# Altium schematic sheet Key_LED_Buzzer.SchDoc
size A3; SheetNumber: 8; SheetTotal: 12
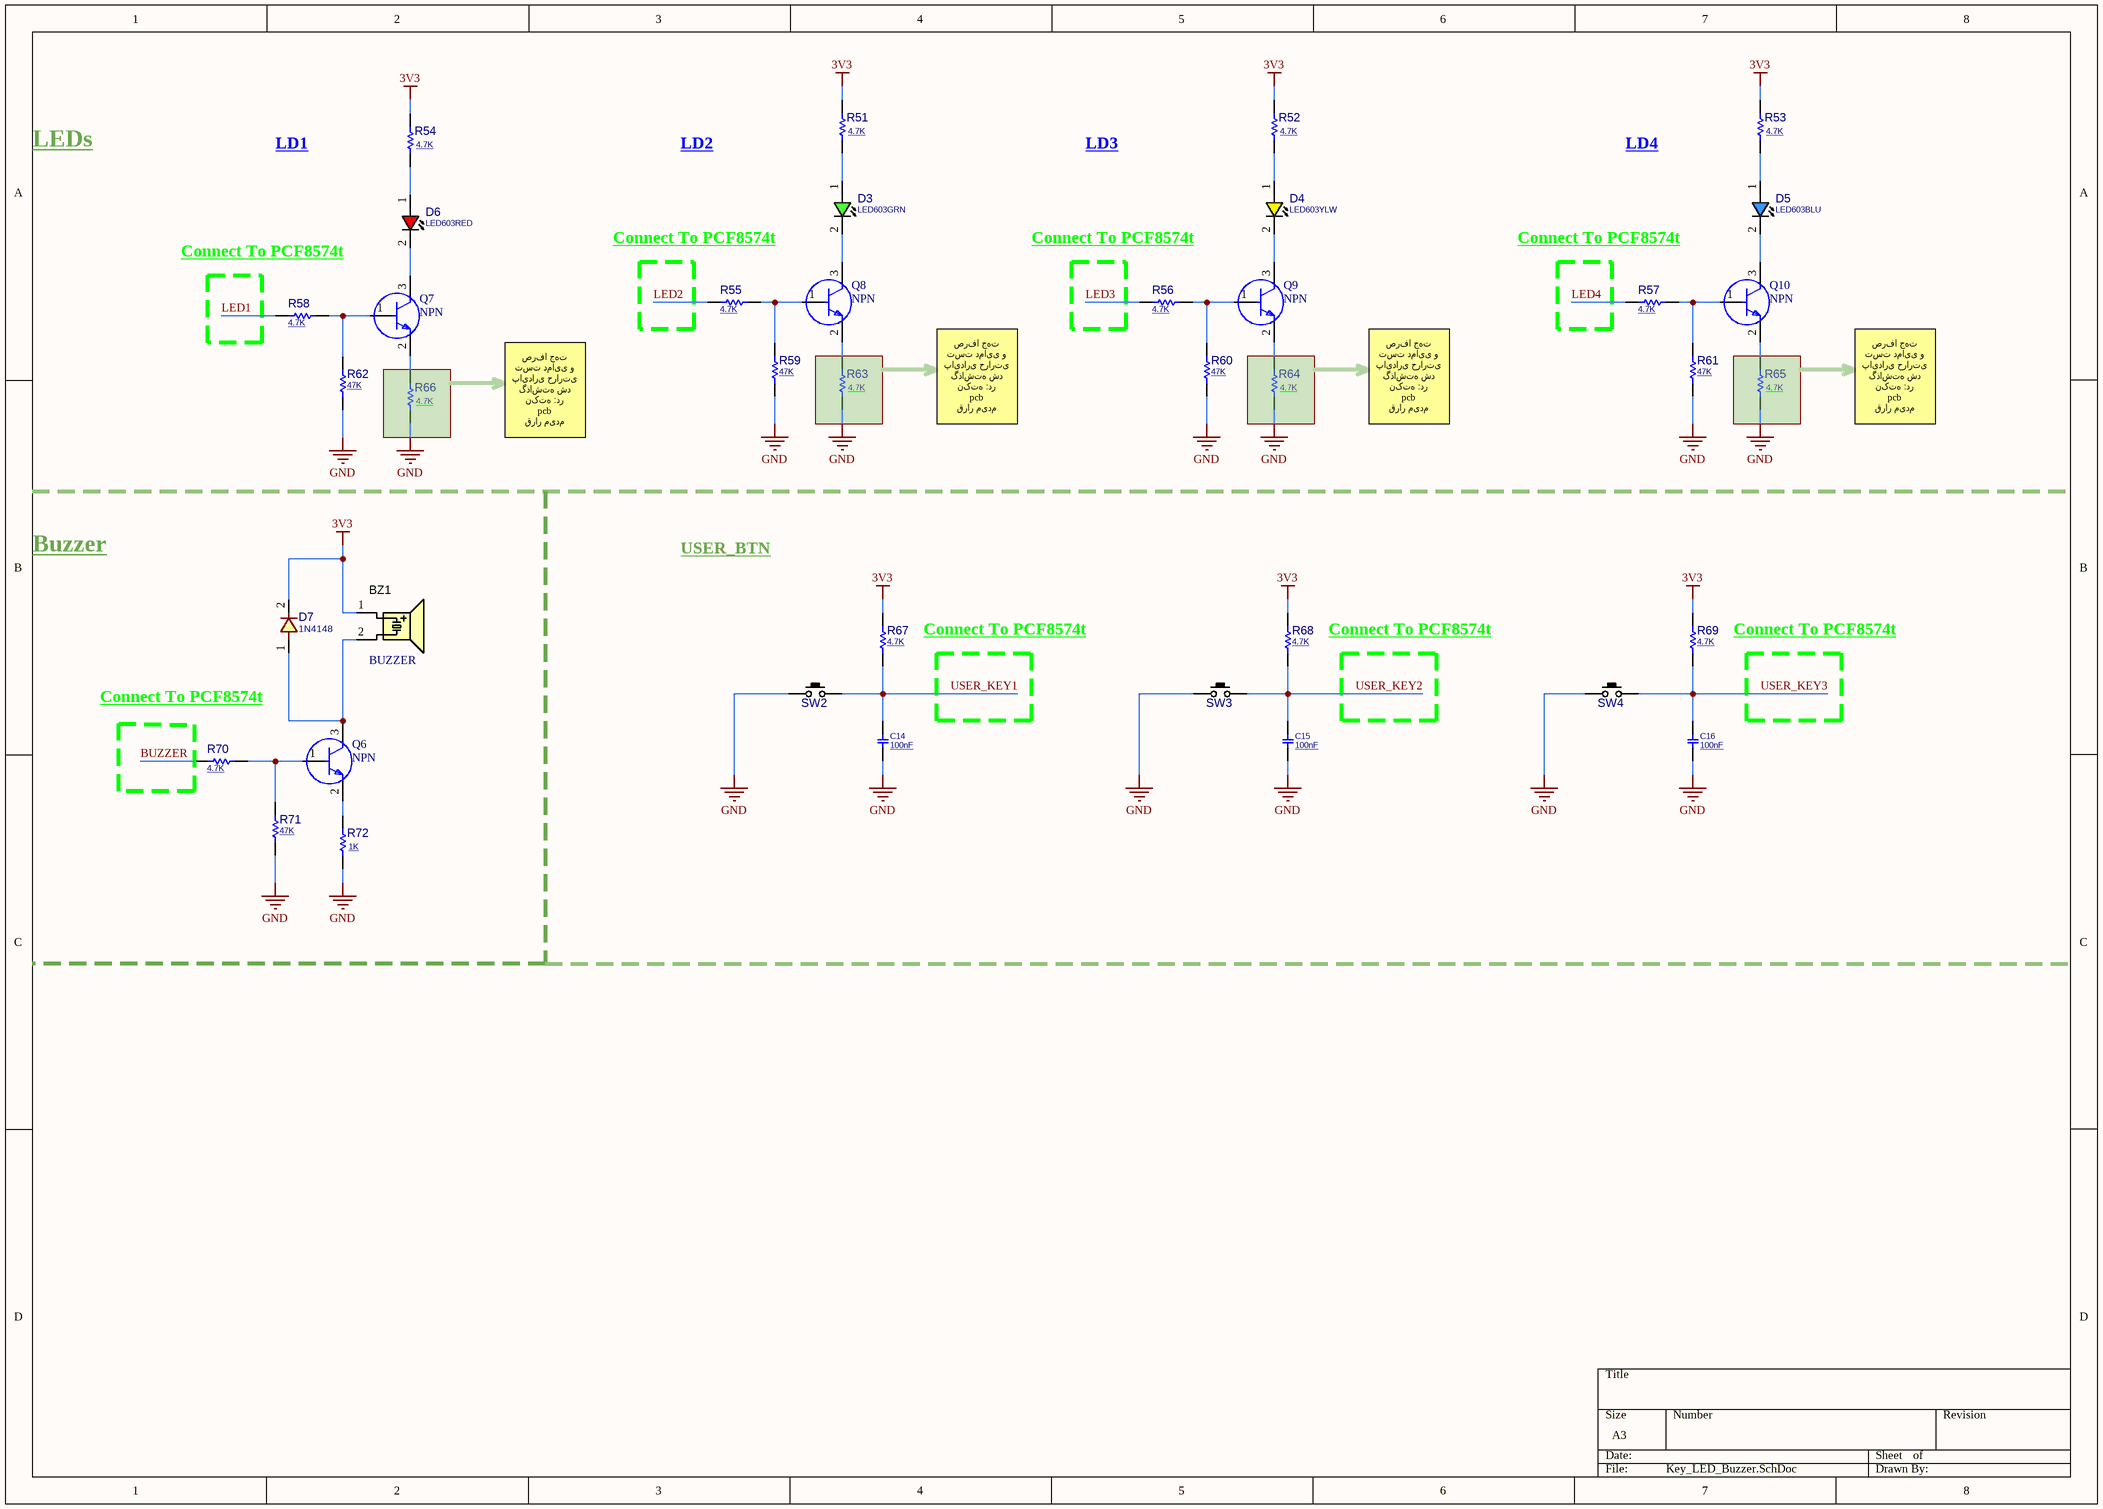
[diagram p0: Key_LED_Buzzer.SchDoc]

## Parts
BZ1  BUZZER  [BZ_SMD_S8]
C14  100nF  [C0603]
C15  100nF  [C0603]
C16  100nF  [C0603]
D3  LED603GRN  [LED0603GRN]
D4  LED603YLW  [LED0603YLW]
D5  LED603BLU  [LED0603BLU]
D6  LED603RED  [LED0603RED]
D7  1N4148  [D_SOD80]
Q6  NPN  [FP-SOT23-IPC_A]
Q7  NPN  [FP-SOT23-IPC_A]
Q8  NPN  [FP-SOT23-IPC_A]
Q9  NPN  [FP-SOT23-IPC_A]
Q10  NPN  [FP-SOT23-IPC_A]
R51  4.7K  [R0603]
R52  4.7K  [R0603]
R53  4.7K  [R0603]
R54  4.7K  [R0603]
R55  4.7K  [R0603]
R56  4.7K  [R0603]
R57  4.7K  [R0603]
R58  4.7K  [R0603]
R59  47K  [R0603]
R60  47K  [R0603]
R61  47K  [R0603]
R62  47K  [R0603]
R63  4.7K  [R0603]
R64  4.7K  [R0603]
R65  4.7K  [R0603]
R66  4.7K  [R0603]
R67  4.7K  [R0603]
R68  4.7K  [R0603]
R69  4.7K  [R0603]
R70  4.7K  [R0603]
R71  47K  [R0603]
R72  1K  [R0603]
SW2  PUSHBUTTON  [SWPBS_SPST_6X3X5]  (value not drawn)
SW3  PUSHBUTTON  [SWPBS_SPST_6X3X5]  (value not drawn)
SW4  PUSHBUTTON  [SWPBS_SPST_6X3X5]  (value not drawn)

## Nets
3V3: BZ1.1(A) D7.2 R51.2 R52.2 R53.2 R54.2 R67.1 R68.1 R69.1
GND: C14.1 C15.1 C16.1 R59.2 R60.2 R61.2 R62.2 R63.1 R64.1 R65.1 R66.1 R71.2 R72.1 SW2.1(P1) SW3.1(P1) SW4.1(P1)
BUZZER: R70.2
LED1: R58.2
LED2: R55.2
LED3: R56.2
LED4: R57.2
USER_KEY1: C14.2 R67.2 SW2.2(P3)
USER_KEY2: C15.2 R68.2 SW3.2(P3)
USER_KEY3: C16.2 R69.2 SW4.2(P3)
NetBZ1_2: BZ1.2(B) D7.1 Q6.3(C)
NetD3_1: D3.1(ANODE) R51.1
NetD3_2: D3.2(CATHODE) Q8.3(C)
NetD4_1: D4.1(ANODE) R52.1
NetD4_2: D4.2(CATHODE) Q9.3(C)
NetD5_1: D5.1(ANODE) R53.1
NetD5_2: D5.2(CATHODE) Q10.3(C)
NetD6_1: D6.1(ANODE) R54.1
NetD6_2: D6.2(CATHODE) Q7.3(C)
NetQ6_1: Q6.1(B) R70.1 R71.1
NetQ6_2: Q6.2(E) R72.2
NetQ7_1: Q7.1(B) R58.1 R62.1
NetQ7_2: Q7.2(E) R66.2
NetQ8_1: Q8.1(B) R55.1 R59.1
NetQ8_2: Q8.2(E) R63.2
NetQ9_1: Q9.1(B) R56.1 R60.1
NetQ9_2: Q9.2(E) R64.2
NetQ10_1: Q10.1(B) R57.1 R61.1
NetQ10_2: Q10.2(E) R65.2

## Notes on the sheet
- LEDs
- LD1
- LD2
- LD3
- LD4
- Connect To PCF8574t
- صرفا جهت تست دمایی و پایداری حرارتی گذاشته شد نکته :در
  pcb
  قرار میدم
- Buzzer
- USER_BTN
- (near R67) Connect To PCF8574t
- (near R68) Connect To PCF8574t
- (near R69) Connect To PCF8574t

## Library data of the parts
BZ1 = BZ_SMD_8X8X3: Buzzer, SMD, sealed 8.5x8.5x3mm LWH , 3Vp; PARAM: 2700 Hz, Magnetic; PARAM2: 2.7kHz, 85dBA @ 10cm; MANF: cre-sound; MANF_P#: LET8530BS-03L-2.7-16-R; PRICE: 2t@Javan; Value: BUZZER
C14-C16 = CAP_SMD_MLCC_0603: CAP, MLCC, -F, -V, MATERIAL, -%, 0201; PARAM: -, -%; MANF_P#: MANF_PART#; PRICE: 100= 1$; MANF: -; PARAM2: -V; ASSEMBLY: ASSEMBLY; VALUE: 100nF
D3 = LED_SMD_0603_GRN: LED, SMD, 0603, GREEN; PARAM: 20mA; MANF: Kingbright; DESC: DESCRIPTION; MANF_P#: APT1608SGC; PARAM2: 2.2V; ASSEMBLY: ASSEMBLY; PRICE: 1: 0.14$, 100: 6.8$; VALUE: LED603GRN
D4 = LED_SMD_0603_YLW: LED, SMD, 0603, YELLOW; DESC: DESCRIPTION; MANF_P#: MANF_PART#; PARAM2: 2.2V; MANF: MANF; ASSEMBLY: ASSEMBLY; PRICE: PRICE; VALUE: LED603YLW
D5 = LED_SMD_0603_BLU: LED, SMD, 0603, BLUE; PARAM: 30mA, 470nm, 120° Angle; DESC: DESCRIPTION; MANF_P#: MANF_PART#; PARAM2: 2.2~3V; MANF: MANF; ASSEMBLY: ASSEMBLY; PRICE: PRICE; VALUE: LED603BLU
D6 = LED_SMD_0603_RED: LED, SMD, 0603, RED; PARAM: 30mA, 640nm; DESC: DESCRIPTION; MANF_P#: MANF_PART#; PARAM2: 1.8~2.5V; MANF: MANF; ASSEMBLY: ASSEMBLY; PRICE: PRICE; VALUE: LED603RED
D7 = DIODE_SMD_1N4148_SOD80: DIODE, FAST SWTICHING, 0.3A, 0.5W; DESC: DESCRIPTION; PARAM: 75V; PARAM2: 300mA, 0.5W; MANF: MANF; ASSEMBLY: ASSEMBLY; PRICE: PRICE; MANF_P#: 1N4148; VALUE: 1N4148
Q6-Q10 = CMP-2000-04931-2: Frequency: 300MHz; Collector Emitter Voltage (VCEO): 40V; Power Dissipation: 350mW; Element Configuration: Single; Max Power Dissipation: 300mW; Max Collector Current: 200mA; Collector Emitter Saturation Voltage: 300mV; Number of Elements: 1; hFE Min: 100; Collector Base Voltage (VCBO): 60V; Emitter Base Voltage (VEBO): 6V; Contact Plating: Tin; Package Quantity: 3000; Max Frequency: 300MHz; REACH SVHC: No SVHC; Max Operating Temperature: 150°C; Width: 1.4mm; Voltage Rating (DC): 40V; Radiation Hardening: No; Case/Package: SOT-23; Height: 1mm; Collector Emitter Breakdown Voltage: 40V; Length: 3.05mm; Polarity: NPN; Packaging: Tape and Reel; Number of Pins: 3; Min Operating Temperature: -55°C; Gain Bandwidth Product: 300MHz; Mount: Surface Mount; Weight: 0.000282oz; Continuous Collector Current: 200mA; Transition Frequency: 300MHz; Max Breakdown Voltage: 40V; Lead Free: Lead Free
R51-R72 = RES_SMD: RESISTOR, SMD; PARAM: -W; DESC: DESCRIPTION; DIST#: MOUSER; PARAM2: 1%; MANF_P#: -; MANF: -; ASSEMBLY: ASSEMBLY; PRICE: 100= 0.5$
  R51-R58 R63-R70: VALUE: 4.7K
  R59-R62 R71: VALUE: 47K
  R72: VALUE: 1K
SW2-SW4 = SWPBS_SPST_6X3X5: SWITCH, PUSH BUTTON, TACTILE, SMD, SPST, 6X3.5X5mm; MANF: ALPS; DESC: DESCRIPTION; MANF_P#: SKQMBBE010; VALUE: PUSHBUTTON; ASSEMBLY: ASSEMBLY; PARAM: PARAM; PRICE: PRICE